# EAGLE design Verna_Dorian_334CC (EAGLE 9.6.2)
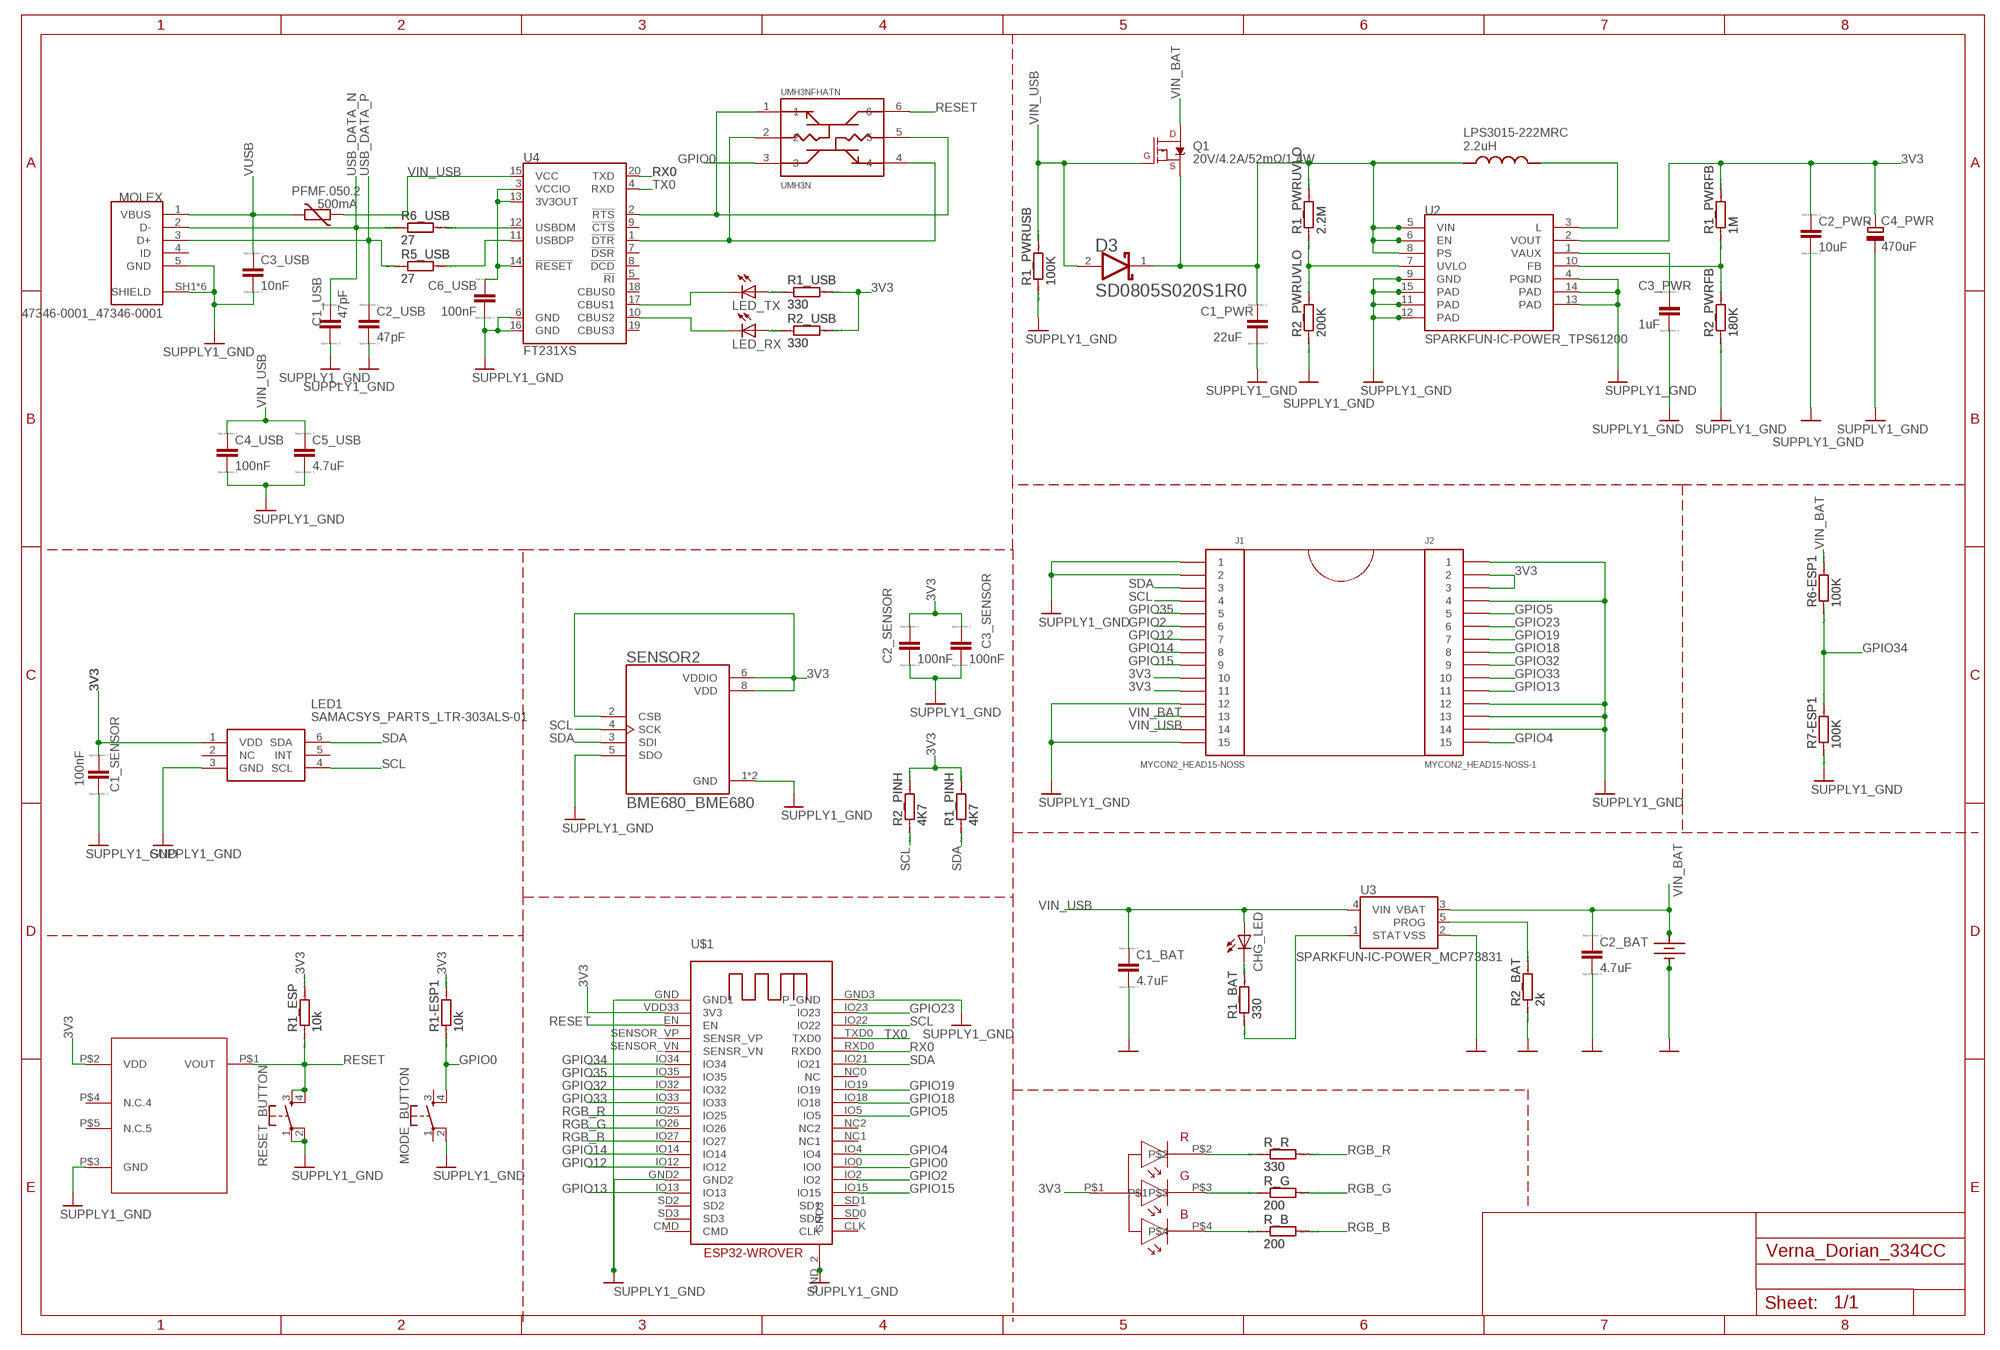
[diagram p0: schematic, sheet 1]

## Parts
18650BATTHOLDER  12BHC186CLP-GR_12BHC186CLP-GR  [12BHC186CLP-GR_12BHC186CLP-GR]
C1_BAT  4.7uF  EAGLE-LTSPICE_CC0402  [EAGLE-LTSPICE_C0402]
C1_PWR  22uF  EAGLE-LTSPICE_CC0402  [EAGLE-LTSPICE_C0402]
C1_SENSOR  100nF  EAGLE-LTSPICE_CC0402  [EAGLE-LTSPICE_C0402]
C1_USB  47pF  EAGLE-LTSPICE_CC0402  [EAGLE-LTSPICE_C0402]
C2_BAT  4.7uF  EAGLE-LTSPICE_CC0402  [EAGLE-LTSPICE_C0402]
C2_PWR  10uF  EAGLE-LTSPICE_CC0402  [EAGLE-LTSPICE_C0402]
C2_SENSOR  100nF  EAGLE-LTSPICE_CC0402  [EAGLE-LTSPICE_C0402]
C2_USB  47pF  EAGLE-LTSPICE_CC0402  [EAGLE-LTSPICE_C0402]
C3_PWR  1uF  EAGLE-LTSPICE_CC0402  [EAGLE-LTSPICE_C0402]
C3_SENSOR  100nF  EAGLE-LTSPICE_CC0402  [EAGLE-LTSPICE_C0402]
C3_USB  10nF  EAGLE-LTSPICE_CC0402  [EAGLE-LTSPICE_C0402]
C4_PWR  470uF  RCL_CPOL-EUD/7343-31R  [RCL_D/7343-31R]
C4_USB  100nF  EAGLE-LTSPICE_CC0402  [EAGLE-LTSPICE_C0402]
C5_USB  4.7uF  EAGLE-LTSPICE_CC0402  [EAGLE-LTSPICE_C0402]
C6_USB  100nF  EAGLE-LTSPICE_CC0402  [EAGLE-LTSPICE_C0402]
CHG_LED  ADAFRUIT_LEDCHIP-LED0603  [ADAFRUIT_CHIP-LED0603]
D3  AVX---SD0805S020S1R0_AVX_SD0805S020S1R0AVX_SD0805S020S1R0_0_0  [AVX---SD0805S020S1R0_AVX_SD0805S020S1R0_0]
J1  MYCON2_HEAD15-NOSS  [MYCON2_HEAD15-NOSS]
J2  MYCON2_HEAD15-NOSS-1  [MYCON2_HEAD15-NOSS-1]
LED1  SAMACSYS_PARTS_LTR-303ALS-01  [SAMACSYS_PARTS_LTR303ALS01]
LED_RX  ADAFRUIT_LEDCHIP-LED0603  [ADAFRUIT_CHIP-LED0603]
LED_TX  ADAFRUIT_LEDCHIP-LED0603  [ADAFRUIT_CHIP-LED0603]
MODE_BUTTON  SPARKFUN-SWITCHES_MOMENTARY-SWITCH-SPST-2-SMD-4.6X2.8MM  [SPARKFUN-SWITCHES_TACTILE_SWITCH_SMD_4.6X2.8MM]
MOLEX  47346-0001_47346-0001  [47346-0001_MOLEX_47346-0001]
PFMF.050.2  500mA  VARISTOR_VARISTORCN1812  [VARISTOR_CT/CN1812]
Q1  20V/4.2A/52mΩ/1.4W  SPARKFUN-DISCRETESEMI_MOSFET_PCH-DMG2305UX-7  [SPARKFUN-DISCRETESEMI_SOT23-3]
R1-ESP1  10k  EAGLE-LTSPICE_RR0402  [EAGLE-LTSPICE_R0402]
R1_BAT  330  EAGLE-LTSPICE_RR0402  [EAGLE-LTSPICE_R0402]
R1_ESP  10k  EAGLE-LTSPICE_RR0402  [EAGLE-LTSPICE_R0402]
R1_PINH  4K7  EAGLE-LTSPICE_RR0402  [EAGLE-LTSPICE_R0402]
R1_PWRFB  1M  EAGLE-LTSPICE_RR0402  [EAGLE-LTSPICE_R0402]
R1_PWRUSB  100K  EAGLE-LTSPICE_RR0402  [EAGLE-LTSPICE_R0402]
R1_PWRUVLO  2.2M  EAGLE-LTSPICE_RR0402  [EAGLE-LTSPICE_R0402]
R1_USB  330  EAGLE-LTSPICE_RR0402  [EAGLE-LTSPICE_R0402]
R2_BAT  2k  EAGLE-LTSPICE_RR0402  [EAGLE-LTSPICE_R0402]
R2_PINH  4K7  EAGLE-LTSPICE_RR0402  [EAGLE-LTSPICE_R0402]
R2_PWRFB  180K  EAGLE-LTSPICE_RR0402  [EAGLE-LTSPICE_R0402]
R2_PWRUVLO  200K  EAGLE-LTSPICE_RR0402  [EAGLE-LTSPICE_R0402]
R2_USB  330  EAGLE-LTSPICE_RR0402  [EAGLE-LTSPICE_R0402]
R5_USB  27  EAGLE-LTSPICE_RR0402  [EAGLE-LTSPICE_R0402]
R6-ESP1  100K  EAGLE-LTSPICE_RR0402  [EAGLE-LTSPICE_R0402]
R6_USB  27  EAGLE-LTSPICE_RR0402  [EAGLE-LTSPICE_R0402]
R7-ESP1  100K  EAGLE-LTSPICE_RR0402  [EAGLE-LTSPICE_R0402]
R_B  200  EAGLE-LTSPICE_RR0402  [EAGLE-LTSPICE_R0402]
R_G  200  EAGLE-LTSPICE_RR0402  [EAGLE-LTSPICE_R0402]
R_R  330  EAGLE-LTSPICE_RR0402  [EAGLE-LTSPICE_R0402]
RESET_BUTTON  SPARKFUN-SWITCHES_MOMENTARY-SWITCH-SPST-2-SMD-4.6X2.8MM  [SPARKFUN-SWITCHES_TACTILE_SWITCH_SMD_4.6X2.8MM]
SENSOR2  BME680_BME680  [BME680_PSON80P300X300X100-8N]
U2  SPARKFUN-IC-POWER_TPS61200  [SPARKFUN-IC-POWER_QFN-10_PAD]
U3  SPARKFUN-IC-POWER_MCP73831  [SPARKFUN-IC-POWER_SOT23-5]
U4  FT231XS  SPARKFUN-IC-COMMS_FT231XS  [SPARKFUN-IC-COMMS_SSOP20_L]
U$1  ESP32-WROVER_ESP32-WROVER  [ESP32-WROVER_ESP32-WROVER]
U$2  150202M153130_150202M153130-RGB  [150202M153130_150202M153130]
U$3  BD48E27G-TR_BD48E27G-TR  [BD48E27G-TR_SSOP5]
U$6  LPS3015_LPS3015  [LPS3015_LPS3015-222MRC]
UMH3NFHATN  UMH3N_UMH3N  [UMH3N_SOP65P210X100-6N]

## Nets
3V3: C1_SENSOR.1 C2_PWR.1 C2_SENSOR.1 C3_SENSOR.1 C4_PWR.+ J1.10 J1.11 J2.2 J2.3 LED1.1(VDD) R1-ESP1.2 R1_ESP.2 R1_PINH.2 R1_PWRFB.2 R1_USB.2 R2_PINH.2 R2_USB.2 SENSOR2.2(CSB) SENSOR2.6(VDDIO) SENSOR2.8(VDD) U2.2(VOUT) U$1.VDD33(3V3) U$2.P$1 U$3.P$2(VDD)
GND: 18650BATTHOLDER.P$1(G) 18650BATTHOLDER.P$3(G) 18650BATTHOLDER.P$4(G) C1_BAT.2 C1_PWR.2 C1_SENSOR.2 C1_USB.2 C2_BAT.2 C2_PWR.2 C2_SENSOR.2 C2_USB.2 C3_PWR.2 C3_SENSOR.2 C3_USB.2 C4_PWR.- C4_USB.2 C5_USB.2 C6_USB.2 J1.1 J1.2 J1.12 J1.15 J2.1 J2.4 J2.12 J2.13 J2.14 LED1.3(GND) MODE_BUTTON.2 MOLEX.5(GND) MOLEX.SH1(SHIELD) MOLEX.SH2(SHIELD) MOLEX.SH3(SHIELD) MOLEX.SH4(SHIELD) MOLEX.SH5(SHIELD) MOLEX.SH6(SHIELD) R1_PWRUSB.1 R2_BAT.1 R2_PWRFB.1 R2_PWRUVLO.1 R7-ESP1.1 RESET_BUTTON.1 RESET_BUTTON.2 SENSOR2.1(GND) SENSOR2.5(SDO) SENSOR2.7(GND) U2.4(PGND) U2.9(GND) U2.11(PAD) U2.12(PAD) U2.13(PAD) U2.14(PAD) U2.15(PAD) U3.2(VSS) U4.6(GND) U4.16(GND) U$1.GND2 U$1.GND3(P_GND) U$1.GND(GND1) U$1.GND_2(GND3) U$3.P$3(GND) ; supply symbol labelled SUPPLY1_GND
GPIO0: MODE_BUTTON.4 R1-ESP1.1 U$1.IO0 UMH3NFHATN.3
GPIO2: J1.6 U$1.IO2
GPIO4: J2.15 U$1.IO4
GPIO5: J2.5 U$1.IO5
GPIO12: J1.7 U$1.IO12
GPIO13: J2.11 U$1.IO13
GPIO14: J1.8 U$1.IO14
GPIO15: J1.9 U$1.IO15
GPIO18: J2.8 U$1.IO18
GPIO19: J2.7 U$1.IO19
GPIO23: J2.6 U$1.IO23
GPIO32: J2.9 U$1.IO32
GPIO33: J2.10 U$1.IO33
GPIO34: R6-ESP1.1 R7-ESP1.2 U$1.IO34
GPIO35: J1.5 U$1.IO35
N$1: R_R.1 U$2.P$2
N$2: R_G.1 U$2.P$3
N$3: R_B.1 U$2.P$4
N$4: U2.3(L) U$6.P$2
N$5: CHG_LED.C R1_BAT.2
N$6: R1_BAT.1 U3.1(STAT)
N$7: R2_BAT.2 U3.5(PROG)
N$8: R6_USB.2 U4.12(USBDM)
N$9: C3_PWR.1 U2.1(VAUX)
N$11: R5_USB.2 U4.11(USBDP)
N$12: R1_PWRUVLO.1 R2_PWRUVLO.2 U2.7(UVLO)
N$13: R1_PWRFB.1 R2_PWRFB.2 U2.10(FB)
N$17: C6_USB.1 U4.3(VCCIO) U4.13(3V3OUT) U4.14(!RESET)
N$20: LED_TX.C U4.17(CBUS1)
N$21: LED_RX.C U4.10(CBUS2)
N$22: LED_TX.A R1_USB.1
N$23: LED_RX.A R2_USB.1
N$25: U4.1(!DTR) UMH3NFHATN.2 UMH3NFHATN.4
N$27: U4.2(!RTS) UMH3NFHATN.1 UMH3NFHATN.5
RESET: R1_ESP.1 RESET_BUTTON.3 RESET_BUTTON.4 U$1.EN U$3.P$1(VOUT) UMH3NFHATN.6
RGB_B: R_B.2 U$1.IO27
RGB_G: R_G.2 U$1.IO26
RGB_R: R_R.2 U$1.IO25
RX0: U4.20(TXD) U$1.RXD0
SCL: J1.4 LED1.4(SCL) R2_PINH.1 SENSOR2.4(SCK) U$1.IO22
SDA: J1.3 LED1.6(SDA) R1_PINH.1 SENSOR2.3(SDI) U$1.IO21
TX0: U4.4(RXD) U$1.TXD0
USB_DATA_N [New Class]: C1_USB.1 MOLEX.2(D-) R6_USB.1
USB_DATA_P [New Class]: C2_USB.1 MOLEX.3(D+) R5_USB.1
VIN: C1_PWR.1 D3.1(CATHODE) Q1.2(S) R1_PWRUVLO.2 U2.5(VIN) U2.6(EN) U2.8(PS) U$6.P$1
VIN_BAT: 18650BATTHOLDER.P$2(P) 18650BATTHOLDER.P$5(P) 18650BATTHOLDER.P$6(P) C2_BAT.1 J1.13 Q1.3(D) R6-ESP1.2 U3.3(VBAT)
VIN_USB: C1_BAT.1 C4_USB.1 C5_USB.1 CHG_LED.A D3.2(ANODE) J1.14 PFMF.050.2.1 Q1.1(G) R1_PWRUSB.2 U3.4(VIN) U4.15(VCC)
VUSB: C3_USB.1 MOLEX.1(VBUS) PFMF.050.2.2
Unconnected: LED1.2(NC) LED1.5(INT) MODE_BUTTON.1 MODE_BUTTON.3 MOLEX.4(ID) U4.5(!RI) U4.7(!DSR) U4.8(!DCD) U4.9(!CTS) U4.18(CBUS0) U4.19(CBUS3) U$1.CLK U$1.CMD U$1.NC0(NC) U$1.NC1 U$1.NC2 U$1.SD0 U$1.SD1 U$1.SD2 U$1.SD3 U$1.SENSOR_VN(SENSR_VN) U$1.SENSOR_VP(SENSR_VP) U$3.P$4(N.C.4) U$3.P$5(N.C.5)

## Library data of the parts
18650BATTHOLDER = ESP32_WROVER:12BHC186CLP-GR_12BHC186CLP-GR
C1_BAT C1_PWR C1_SENSOR C1_USB C2_BAT C2_PWR C2_SENSOR C2_USB C3_PWR C3_SENSOR C3_USB C4_USB C5_USB C6_USB = ESP32_WROVER:EAGLE-LTSPICE_C: CAPACITOR, European symbol; SPICEMODEL: NONE; SPICEPREFIX: C
C4_PWR = ESP32_WROVER:RCL_CPOL-EU: POLARIZED CAPACITOR, European symbol; SPICEPREFIX: C
CHG_LED LED_RX LED_TX = ESP32_WROVER:ADAFRUIT_LED: LED OSRAM: - CHIPLED LG R971, LG N971, LY N971, LG Q971, LY Q971, LO R971, LY R971 LH N974, LH R974 LS Q976, LO Q976, LY Q976 LO Q996 - Hyper CHIPLED LW Q18S LB Q993, LB Q99A, LB R99A - SideLED LS A670, LO A670, LY A670, LG A670, LP A670 LB A673, LV A673, LT A673, LW A673 LH A674 LY A675 LS A676, LA A676, LO A676, LY A676, LW A676 LS A679, LY A679, LG A679 - Hyper Micro SIDELED® LS Y876, LA Y876, LO Y876, LY Y876 LT Y87S - SmartLED LW L88C, LW L88S LB L89C, LB L89S, LG L890 LS L89K, LO L89K, LY L89K LS L896, LA L896, LO L896, LY L896 - TOPLED LS T670, LO T670, LY T670, LG T670, LP T670 LSG T670, LSP T670, LSY T670, LOP T670, LYG T670 LG T671, LOG T671, LSG T671 LB T673, LV T673, LT T673, LW T673 LH T674 LS T676, LA T676, LO T676, LY T676, LB T676, LH T676, LSB T676, LW T676 LB T67C, LV T67C, LT T67C, LS T67K, LO T67K, LY T67K, LW E67C LS E67B, LA E67B, LO E67B, LY E67B, LB E67C, LV E67C, LT E67C LW T67C LS T679, LY T679, LG T679 LS T770, LO T770, LY T770, LG T770, LP T770 LB T773, LV T773, LT T773, LW T773 LH T774 LS E675, LA E675, LY E675, LS T675 LS T776, LA T776, LO T776, LY T776, LB T776 LHGB T686 LT T68C, LB T68C - Hyper Mini TOPLED® LB M676 - Mini TOPLED Santana® LG M470 LS M47K, LO M47K, LY M47K Source: http://www.osram.convergy.de/
D3 = ESP32_WROVER:AVX---SD0805S020S1R0_AVX_SD0805S020S1R0: Schottky Barrier Rectifier Diode; CENTROID_NOT_SPECIFIED: No; DATASHEET: http://datasheets.avx.com/schottky.pdf; DIGIKEY_DESCRIPTION: DIODE SCHOTTKY 20V 1A 0805; DIGIKEY_PART_NUMBER: 478-7800-1-ND; LEAD_FREE: yes; MF: AVX; MOUSER_PART_NUMBER: 581-SD0805S020S1R0; MPN: SD0805S020S1R0; PACKAGE: 0805 (2012 metric); PREFIX: D; ROHS: yes; TEMPERATURE_RANGE_HIGH: +125°C; TEMPERATURE_RANGE_LOW: -55°C
J1 = ESP32_WROVER:MYCON2_HEAD15-NOSS
J2 = ESP32_WROVER:MYCON2_HEAD15-NOSS-1
LED1 = ESP32_WROVER:SAMACSYS_PARTS_LTR-303ALS-01: Ambient Light Sensors Ambient Light Photo Sensor Source: Datasheet <http://optoelectronics.liteon.com/upload/download/DS86-2013-0004/LTR-303ALS-01_DS_V1.pdf>; ARROW_PART_NUMBER: LTR-303ALS-01; ARROW_PRICE-STOCK: https://www.arrow.com/en/products/ltr-303als-01/lite-on-technology?region=nac; DESCRIPTION: Ambient Light Sensors Ambient Light Photo Sensor; HEIGHT: 0mm; MANUFACTURER_NAME: Lite-On; MANUFACTURER_PART_NUMBER: LTR-303ALS-01; MOUSER_PART_NUMBER: 859-LTR-303ALS-01; MOUSER_PRICE-STOCK: https://www.mouser.co.uk/ProductDetail/Lite-On/LTR-303ALS-01?qs=Ml%2FaxAEbwm%252Bm%252BetMkBDC8g%3D%3D
MODE_BUTTON RESET_BUTTON = ESP32_WROVER:SPARKFUN-SWITCHES_MOMENTARY-SWITCH-SPST-2: Momentary Switch (Pushbutton) - SPST - Two Circuits Normally-open (NO) SPST momentary switches (buttons, pushbuttons). Schematic symbol includes two switch circuits. Variants SMD-4.6MMX2.8MM - 4.60mm x 2.80mm Tactile Momentary Button Switch - Used on SparkFun SAMD21 Mini Breakout <https://www.sparkfun.com/products/13664> SMD-5.2MM - Mini Pushbutton Switch - SMD <https://www.sparkfun.com/products/8720> - Used on Arduino Pro Mini <https://www.sparkfun.com/products/11114>; PROD_ID: SWCH-14139; SF_SKU: COM-08720
MOLEX = ESP32_WROVER:47346-0001_47346-0001: CONN RCPT 5POS MICRO USB R/A SMD Check prices <https://pricing.snapeda.com/parts/47346-0001/Molex/view-part?ref=eda>; AVAILABILITY: Warning; DESCRIPTION: USB - micro B USB 2.0 Receptacle Connector 5 Position Surface Mount, Right Angle; MF: Molex; MP: 47346-0001; PACKAGE: None; PRICE: None
PFMF.050.2 = ESP32_WROVER:VARISTOR_VARISTOR: VARISTOR
Q1 = ESP32_WROVER:SPARKFUN-DISCRETESEMI_MOSFET_PCH: P-channel MOSFETs Voltage controlled devices that allow control of high current outputs. SparkFun Products: SparkFun ESP32 Thing <https://www.sparkfun.com/products/13907> SparkFun ESP8266 Thing <https://www.sparkfun.com/products/13231> SparkFun Pi Servo HAT V2 <https://www.sparkfun.com/products/15316> DMG2305UX-7 (20V/4.2A/SOT23-3); PROD_ID: TRAN-14388
R1-ESP1 R1_BAT R1_ESP R1_PINH R1_PWRFB R1_PWRUSB R1_PWRUVLO R1_USB R2_BAT R2_PINH R2_PWRFB R2_PWRUVLO R2_USB R5_USB R6-ESP1 R6_USB R7-ESP1 R_B R_G R_R = ESP32_WROVER:EAGLE-LTSPICE_R: RESISTOR, European symbol; SPICEMODEL: NONE; SPICEPREFIX: R
SENSOR2 = ESP32_WROVER:BME680_BME680: Integrated Environmental Unit; AVAILABILITY: Unavailable; DESCRIPTION: Integrated Environmental Unit; MF: Bosch Sensortec; MP: BME680; PACKAGE: LGA-8 Bosch Tools; PRICE: None
U2 = ESP32_WROVER:SPARKFUN-IC-POWER_TPS61200: DC to DC Booster IC-10035; PROD_ID: IC-10035
U3 = ESP32_WROVER:SPARKFUN-IC-POWER_MCP73831: MCP73831T Li-Ion, Li-Pol Controller Miniature single cell, fully integrated Li-Ion, Li-polymer charge management controller Datasheet <http://ww1.microchip.com/downloads/en/DeviceDoc/20001984g.pdf> SparkFun Products: SparkFun ESP32 Thing <https://www.sparkfun.com/products/13907> SparkFun 9DoF Razor IMU M0 <https://www.sparkfun.com/products/14001>; PROD_ID: IC-09995
U4 = ESP32_WROVER:SPARKFUN-IC-COMMS_FT231X: FTDI FT231X Full Speed USB to Full-handshake UART This USB2.0 Full Speed IC offers a compact bridge to full handshake UART interfaces. The device is a UART, capable of operating up to 3MBaud, with low power consumption (8mA). The FT231X includes the complete FT-X series feature set and enables USB to be added into a system design quickly and easily over a UART interface. Datasheet <http://cdn.sparkfun.com/datasheets/Components/General%20IC/DS_FT231X.pdf> SparkFun Products SparkFun RedBoard - Programmed with Arduino <https://www.sparkfun.com/products/12757> (DEV-12757) SparkFun XBee Explorer USB <https://www.sparkfun.com/products/11812> (WRL-11812) SparkFun XBee Explorer Dongle <https://www.sparkfun.com/products/11697> (WRL-11697) SparkFun Blynk Board - ESP8266 <https://www.sparkfun.com/products/13794> (WRL-13794) SparkFun ESP8266 Thing - Dev Board <https://www.sparkfun.com/products/13711> (WRL-13711) SparkFun Block for Intel® Edison - Base <https://www.sparkfun.com/products/13045> (DEV-13045) SparkFun RedStick <https://www.sparkfun.com/products/13741> (DEV-13741) SparkFun Beefy 3 - FTDI Basic Breakout <https://www.sparkfun.com/products/13746> (DEV-13746) SparkFun FT231X Breakout <https://www.sparkfun.com/products/11736> (BOB-11736); PROD_ID: IC-11524
U$1 = ESP32_WROVER:ESP32-WROVER_ESP32-WROVER
U$2 = ESP32_WROVER:150202M153130_150202M153130-RGB
U$3 = ESP32_WROVER:BD48E27G-TR_BD48E27G-TR
U$6 = ESP32_WROVER:LPS3015_LPS3015
UMH3NFHATN = ESP32_WROVER:UMH3N_UMH3N: Dual PNP/NPN transistor for chip reset; AVAILABILITY: Unavailable; DESCRIPTION: Pre-Biased Bipolar Transistor (BJT) 2 NPN - Pre-Biased (Dual) 50V 100mA 250MHz 150mW Surface Mount UMT6; MF: Rohm; MP: UMH3N; PACKAGE: SOT-363 Rohm; PRICE: None

## Board
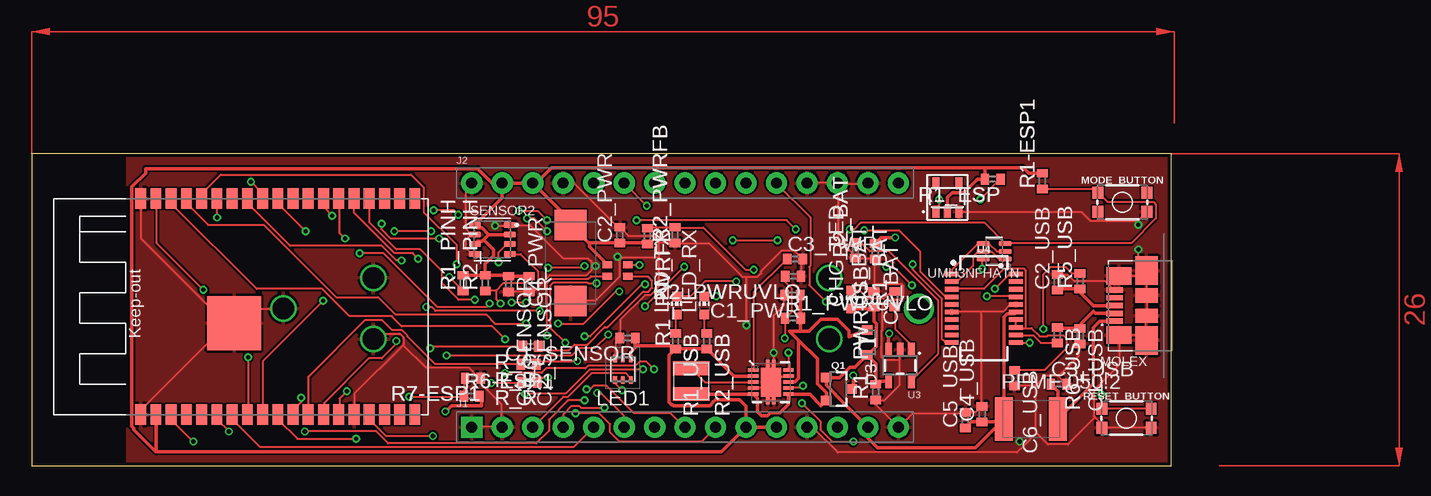
[diagram p1: board, top side]
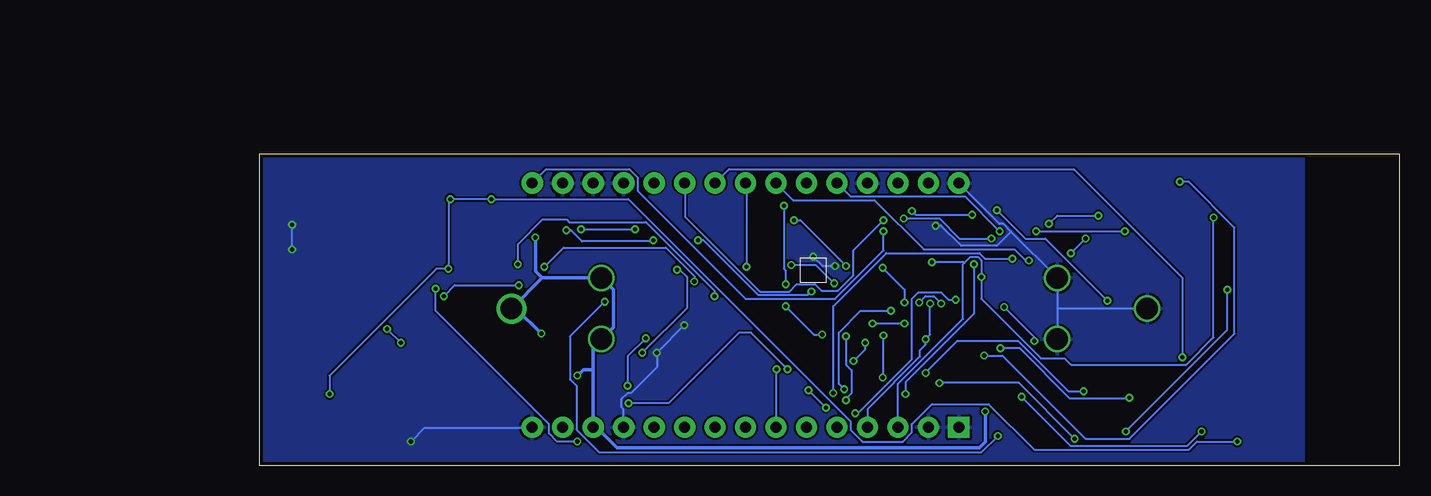
[diagram p2: board, bottom side, seen from below]

Size 95 x 26 mm. Coordinates in mm from the lower left corner, seen from the top.
Outline: 0,0 95,0 95,26 0,26 0,0
Copper layers (1*16): Top 0.035mm / dielectric 1.5mm / Bottom 0.035mm
Design rules "PCB-POOL Standard": minimum track width 0.15mm, minimum drill 0.3mm, track to track 0.15mm, track to pad 0.15mm, pad to pad 0.15mm, via to via 0.15mm, smd to smd 0.15mm, copper to edge 0.3mm, drill to drill 0.2mm, minimum pad ring 0.2mm, minimum via ring 0.15mm, stop-mask expansion 0.03mm, vias tented up to drill 0mil, thermal gap 0.2mm

### Footprints (pad centres in the part's own frame; a part is rotated, then mirrored left to right if it is on the bottom)
12BHC186CLP-GR_12BHC186CLP-GR = drill 1.8: P$1 -26.5,0; P$3 -19,2.55; P$4 -19,-2.55; P$5 19,2.55; P$6 19,-2.55 | drill 1.8 pad 2.5: P$2 26.5,0
EAGLE-LTSPICE_C0402 = smd 0.7 x 0.9: 1 -0.65,0; 2 0.65,0
RCL_D/7343-31R = smd 2.55 x 2.7: + 3.175,0; - -3.175,0
ADAFRUIT_CHIP-LED0603 = smd 0.8 x 0.8: A 0,-0.75; C 0,0.75
AVX---SD0805S020S1R0_AVX_SD0805S020S1R0_0 = smd 0.8 x 0.9: 1 -1.05,0; 2 1.05,0
MYCON2_HEAD15-NOSS = drill 0.914 pad 1.778 square: 1 0,0 | drill 0.914 pad 1.778: 2 2.54,0; 3 5.08,0; 4 7.62,0; 5 10.16,0; 6 12.7,0; 7 15.24,0; 8 17.78,0; 9 20.32,0; 10 22.86,0; 11 25.4,0; 12 27.94,0; 13 30.48,0; 14 33.02,0; 15 35.56,0
MYCON2_HEAD15-NOSS-1 = drill 0.914 pad 1.778: 1 0,0; 2 2.54,0; 3 5.08,0; 4 7.62,0; 5 10.16,0; 6 12.7,0; 7 15.24,0; 8 17.78,0; 9 20.32,0; 10 22.86,0; 11 25.4,0; 12 27.94,0; 13 30.48,0; 14 33.02,0; 15 35.56,0
SAMACSYS_PARTS_LTR303ALS01 = smd 0.3 x 0.65: 1 -0.65,-0.9; 2 0,-0.9; 3 0.65,-0.9; 4 0.65,0.9; 5 0,0.9; 6 -0.65,0.9
SPARKFUN-SWITCHES_TACTILE_SWITCH_SMD_4.6X2.8MM = smd 0.9 x 1: 1 -2.05,-0.8; 2 2.05,-0.8; 3 2.05,0.8; 4 -2.05,0.8
47346-0001_MOLEX_47346-0001 = smd 0.45 x 1.38: 1 -1.3,2.66; 2 -0.65,2.66; 3 0,2.66; 4 0.65,2.66; 5 1.3,2.66 | smd 1.475 x 2.1: SH1 -2.462,2.3; SH2 2.462,2.3 | smd 2.375 x 1.9: SH3 -2.913,0; SH6 2.913,0 | smd 1.175 x 1.9: SH4 -0.838,0; SH5 0.838,0
VARISTOR_CT/CN1812 = smd 1.5 x 3.6: 1 -2.25,0; 2 2.25,0
SPARKFUN-DISCRETESEMI_SOT23-3 = smd 0.8 x 0.9: 1 -0.95,-1; 2 0.95,-1; 3 0,1.1
EAGLE-LTSPICE_R0402 = smd 0.7 x 0.9: 1 -0.65,0; 2 0.65,0
BME680_PSON80P300X300X100-8N = smd 1.016 x 0.5: 1 1.458,1.2; 2 1.458,0.4; 3 1.458,-0.4; 4 1.458,-1.2; 5 -1.458,-1.22; 6 -1.458,-0.4; 7 -1.458,0.4; 8 -1.458,1.2
SPARKFUN-IC-POWER_QFN-10_PAD = smd 0.297 x 0.85: 1 -1,-1.475; 2 -0.5,-1.475; 3 0,-1.475; 4 0.5,-1.475; 5 1,-1.475; 6 1,1.475; 7 0.5,1.475; 8 0,1.475; 9 -0.5,1.475; 10 -1,1.475 | smd 0.7 x 0.28: 11 -1.5,0.25; 12 -1.5,-0.25; 13 1.5,0.25; 14 1.5,-0.25 | smd 2.4 x 1.65: 15 0,0
SPARKFUN-IC-POWER_SOT23-5 = smd 0.55 x 1.2: 1 -0.95,-1.3; 2 0,-1.3; 3 0.95,-1.3; 4 0.95,1.3; 5 -0.95,1.3
SPARKFUN-IC-COMMS_SSOP20_L = smd 0.381 x 1.143: 1 -2.857,-2.68; 2 -2.223,-2.68; 3 -1.587,-2.68; 4 -0.953,-2.68; 5 -0.318,-2.68; 6 0.318,-2.68; 7 0.953,-2.68; 8 1.587,-2.68; 9 2.223,-2.68; 10 2.857,-2.68; 11 2.857,2.68; 12 2.223,2.68; 13 1.587,2.68; 14 0.953,2.68; 15 0.318,2.68; 16 -0.318,2.68; 17 -0.953,2.68; 18 -1.587,2.68; 19 -2.223,2.68; 20 -2.857,2.68
ESP32-WROVER_ESP32-WROVER = smd 1.7 x 0.9: CLK 18,1.27; CMD 0,1.27; EN 0,21.59; GND 0,24.13; GND3 18,24.13; GND_2 0,6.35; IO0 18,7.62; IO2 18,6.35; IO4 18,8.89; IO5 18,12.7; IO12 0,7.62; IO13 0,5.08; IO14 0,8.89; IO15 18,5.08; IO18 18,13.97; IO19 18,15.24; IO21 18,17.78; IO22 18,21.59; IO23 18,22.86; IO25 0,12.7; IO26 0,11.43; IO27 0,10.16; IO32 0,15.24; IO33 0,13.97; IO34 0,17.78; IO35 0,16.51; NC0 18,16.51; NC1 18,10.16; NC2 18,11.43; RXD0 18,19.05; SD0 18,2.54; SD1 18,3.81; SD2 0,3.81; SD3 0,2.54; SENSOR_VN 0,19.05; SENSOR_VP 0,20.32; TXD0 18,20.32; VDD33 0,22.86 | smd 4.5 x 4.5: GND2 7.62,16.34
150202M153130_150202M153130 = smd 0.8 x 0.6: P$1 -0.85,0.475; P$2 -0.85,-0.475; P$3 0.85,-0.475; P$4 0.85,0.475
BD48E27G-TR_SSOP5 = smd 0.6 x 1: P$1 -0.95,-0.8; P$2 0,-0.8; P$3 0.95,-0.8; P$4 0.95,1.6; P$5 -0.95,1.6
LPS3015_LPS3015-222MRC = smd 1.14 x 3.05: P$1 1.075,-0.025; P$2 -1.075,-0.025
UMH3N_SOP65P210X100-6N = smd 1.09 x 0.4: 1 -0.92,0.65; 2 -0.92,0; 3 -0.92,-0.65; 4 0.92,-0.65; 5 0.92,0; 6 0.92,0.65

### Placement (x,y rotation side)
18650BATTHOLDER  47.49,13.09 180 bottom
C1_BAT  70.23,13.87 90 top
C1_PWR  63.43,14.21 180 top
C1_SENSOR  49.67,10.63 180 top
C1_USB  87.4,10.79 270 top
C2_BAT  70.34,17.87 270 top
C2_PWR  49.04,19.21 90 top
C2_SENSOR  41.47,15.13 270 top
C2_USB  85.51,15.29 90 top
C3_PWR  63.65,17.21 0 top
C3_SENSOR  39.77,15.13 270 top
C3_USB  85.62,6.79 0 top
C4_PWR  44.93,16.88 90 top
C4_USB  79.23,4.29 90 top
C5_USB  77.84,3.79 90 top
C6_USB  81.95,7.29 270 top
CHG_LED  68.33,13.84 0 top
D3  69.66,10.26 270 top
J1  36.7,3.2 0 top
J2  36.7,23.55 0 top
LED1  49.29,8.03 180 top
LED_RX  56.08,13.34 0 top
LED_TX  53.77,13.34 0 top
MODE_BUTTON  90.93,21.95 0 top
MOLEX  92.95,13.34 90 top
PFMF.050.2  83.32,3.88 0 top
Q1  67.25,6.38 270 top
R1-ESP1  84.26,23.71 90 top
R1_BAT  71.95,13.87 90 top
R1_ESP  80.12,23.87 180 top
R1_PINH  35.98,15.21 90 top
R1_PWRFB  51.34,19.13 270 top
R1_PWRUSB  70.37,6.13 90 top
R1_PWRUVLO  63.46,12.28 0 top
R1_USB  53.68,10.37 270 top
R2_BAT  68.68,17.95 90 top
R2_PINH  37.82,15.21 90 top
R2_PWRFB  53.64,19.21 90 top
R2_PWRUVLO  63.49,15.78 180 top
R2_USB  56.29,10.37 270 top
R5_USB  87.4,15.37 90 top
R6-ESP1  36.68,5.79 0 top
R6_USB  85.51,10.87 270 top
R7-ESP1  36.79,7.29 180 top
R_B  41.44,8.45 180 top
R_G  41.6,9.95 180 top
R_R  41.52,6.95 180 top
RESET_BUTTON  91.28,3.95 0 top
SENSOR2  38.41,18.85 0 top
U2  61.63,6.95 270 top
U3  72.4,8.35 180 top
U4  79.38,13.11 270 top
U$1  33.23,4.25 90 top
U$2  48.85,16.26 0 top
U$3  76.35,21.95 0 top
U$6  55.01,7.03 270 top
UMH3NFHATN  80.24,17.85 180 top

### Tracks (layer width: path | path; a pad name or v marks a point on that pad's centre or on a via)
3V3
  Top 0.3: J1.10 J1.11 | R1_USB.2 R2_USB.2 58.56,7.45 U2.2 | 41.91,23.42 J2.3 J2.2 | 41.91,23.42 44.93,20.4 C4_PWR.+ 46.42,18.56 46.5,18.56 | R1_PWRFB.2 51.26,18.56 C2_PWR.1 46.5,18.56 | 50.32,10 50.32,9.82 49.94,9.44 LED1.1 | 50.32,10 C1_SENSOR.1 | J1.10 57.53,1.17 10.5,1.17 | J2.2 38.38,23.55 37.19,24.74 9.5,24.74 9.5,24.38 8.35,23.22 8.35,3.27 8.5,3.12 8.5,3 10.33,1.17 10.5,1.17 | 50.32,10 53.4,10 R1_USB.2 | SENSOR2.6 37.2,18.7 37.55,18.7 37.68,18.82 | 38.1,19.25 SENSOR2.2 | 37.68,18.82 38.1,19.25 | J2.2 39.24,22.34 SENSOR2.8 37.2,19.8 37.55,19.8 38.1,19.25 | C2_SENSOR.1 C3_SENSOR.1 39.69,15.86 R2_PINH.2 | R1_PINH.2 R2_PINH.2 | R2_PINH.2 37.82,16.82 38.5,17.5 38.5,18 37.68,18.82 | R1-ESP1.2 83.14,24.36 82.67,24.83 79.5,24.83 | 41.91,23.42 43.33,24.83 79.5,24.83 | 79.5,24.83 79.47,24.8 R1_ESP.2 78.85,23.87 77.72,22.75 76.75,22.75 76.35,22.35 U$3.P$2 | U$2.P$1 46.5,18.23 46.5,18.56 | U$1.VDD33 10.37,1.3 10.5,1.17 | R1_USB.2 53.16,9.2 53.16,5.26 53.34,5.08 53.42,5.08 53.5,5 56.55,5 56.81,5.26 56.81,5.31 57,5.5 59,5.5 59.56,4.94 J1.10
GND  (via drill 0.35)
  Top 0.152: U$1.GND 9.14,4.29 9.14,4.67 16.31,11.84 16.84,11.84 U$1.GND2 | U$1.GND3 9.14,22.2 9.14,18.92 16.23,11.84 U$1.GND2 | 18650BATTHOLDER.P$1 20.95,13.06 18.06,13.06 16.92,11.91 U$1.GND2 | J1.1 36.73,3.23 39.09,3.23 J1.2 39.17,3.23 39.17,5.13 37.49,6.81 37.49,7.27 R7-ESP1.1 37.41,7.34 37.26,7.34 36.42,8.18 32.84,8.18 30.98,10.05 | 30.98,10.05 31.01,10.08 31.01,10.69 30.71,11 28.96,11 18650BATTHOLDER.P$3 | 30.98,10.05 26.9,5.97 26.9,4.29 U$1.GND_2 | C3_SENSOR.2 39.78,14.5 41.45,14.5 C2_SENSOR.2 41.53,14.5 41.83,14.5 43.2,15.88 46.25,15.88 46.71,16.33 46.71,16.64 | 46.71,16.64 46.71,16.94 46.41,17.25 44.35,17.25 41.6,19.99 39.93,19.99 SENSOR2.1 39.85,19.99 v38.63,19.99 | SENSOR2.5 36.88,17.7 36.65,17.7 36.2,18.16 36.2,18.77 36.65,19.23 36.88,19.23 SENSOR2.7 36.58,19.23 36.58,19.38 36.2,19.76 36.2,23.04 36.65,23.5 J2.1 | 70.26,15.11 70.26,17.09 70.33,17.17 C2_BAT.2 70.33,17.25 68.73,17.25 R2_BAT.1 68.66,17.32 68.66,17.48 67.21,18.92 67.21,23.5 J2.13 | 70.26,15.11 70.26,14.58 C1_BAT.2 | J2.12 64.69,23.57 67.13,23.57 J2.13 | J2.14 69.65,23.5 67.28,23.5 J2.13 | 79.17,12.83 81,12.83 81.53,13.36 81.99,13.36 U4.16 | 79.17,12.83 76.73,12.83 U4.6 | 72.39,8.79 72.39,6.73 71.09,5.44 70.48,5.44 R1_PWRUSB.1 70.41,5.44 70.41,5.05 72.24,3.23 J1.15 72.31,3.23 73.46,4.37 77.8,4.37 C5_USB.2 77.88,4.45 78.72,4.45 79.17,4.9 C4_USB.2 79.17,4.98 79.17,12.83 | 72.39,8.79 72.39,9.63 U3.2 | 70.26,15.11 72.54,15.11 72.69,14.96 72.69,14.12 72.39,13.82 71.4,13.82 70.94,13.36 70.94,11.3 70.87,11.23 70.87,9.02 71.09,8.79 72.39,8.79 | LED1.3 48.69,8.94 48.69,10.31 49,10.62 C1_SENSOR.2 49.07,10.69 49.07,12.14 51.13,14.2 51.59,14.2 52.27,14.89 52.27,17.32
  Top 0.152: R2_PWRUVLO.1 64.16,15.8 64.16,17.09 64.24,17.17 C3_PWR.2 64.24,17.25 63.55,17.93 62.56,17.93 60.81,16.18 60.81,16.03 60.5,15.72 59.59,15.72 | 52.31,18.66 51.82,19.15 49.76,19.15 49.07,19.84 C2_PWR.2 49,19.91 48.84,19.91 45.26,23.5 44.35,23.5 J2.4 | 52.31,18.66 52.35,18.62 53.57,18.62 R2_PWRFB.1 53.65,18.54 56.46,18.54 59.28,15.72 59.59,15.72 | 52.27,17.32 52.27,18.62 52.31,18.66 | 49.07,17.17 49.23,17.32 52.27,17.32 | 49.07,17.17 49,17.09 49,15.72 47.02,13.74 44.96,13.74 C4_PWR.- | U2.12 61.42,8.48 61.87,8.48 U2.11 | U2.13 61.87,5.44 61.42,5.44 U2.14 61.34,5.51 61.34,6.58 U2.15 | U2.4 60.2,6.5 61.19,6.5 61.57,6.88 U2.15 | U2.9 63.09,7.42 62.1,7.42 61.65,6.96 U2.15 | U2.11 61.95,8.41 61.95,7.34 U2.15 | C1_PWR.2 62.71,14.2 62.71,13.36 61.87,12.52 v61.87,9.4 61.87,8.56 U2.11 | 92.24,20.41 92.96,21.13 MODE_BUTTON.2 | 92.24,20.41 92.2,20.37 88.32,20.37 87.55,21.13 77.34,21.13 U$3.P$3 | 83.71,6.69 84.51,7.49 85.57,7.49 85.61,7.45 | 83.71,6.69 83.67,6.66 81.99,6.66 C6_USB.2 | 85.61,7.45 86.26,6.81 C3_USB.2 | 85.61,7.45 87.33,9.17 87.33,10.08 C1_USB.2 | 89.84,15.04 90.22,14.66 MOLEX.5 | 89.84,15.04 89.53,15.34 86.94,15.34 86.41,15.88 85.57,15.88 C2_USB.2 | 89.84,15.04 90.6,15.8 MOLEX.SH2 90.68,15.8 92.96,15.8 | 92.96,15.8 92.96,14.2 MOLEX.SH5 92.96,14.12 92.96,12.52 MOLEX.SH4 92.89,12.45 92.89,11.15 92.58,10.85 MOLEX.SH3 92.89,10.47 92.51,10.85 90.68,10.85 MOLEX.SH1 90.68,10.77 90.68,8.41 88.54,6.27 88.54,4.14 88.66,4.03 | 92.96,15.8 92.96,16.18 MOLEX.SH6 | RESET_BUTTON.2 RESET_BUTTON.1 89.15,3.15 89.15,3.53 88.66,4.03 | 92.96,15.8 MOLEX.SH6 | 83.78,2.73 84.73,1.78 86.41,1.78 88.66,4.03
  Top 0.152: 83.78,2.73 83.74,2.77 83.74,6.66 83.71,6.69 | v92.28,20.07 92.28,20.37 92.24,20.41 | v92.28,18.01 92.28,17.02 92.96,16.33 MOLEX.SH6 | 83.78,2.73 82.72,1.66 | 82.72,1.66 82.14,1.09 67.21,1.09 65.15,3.15 64.69,3.15 J1.12 | v59.59,11.68 59.59,15.72 | 82.72,1.66 v82.37,2.01 | v47.02,16.64 46.71,16.64 | 49.07,17.17 v48.84,17.4
  Bottom 0.152: 32.35,19.5 18650BATTHOLDER.P$4 28.5,15.57 28.5,13.13 | 32.35,19.5 32.99,20.14 33.3,20.14 36.65,23.5 J2.1 | v38.63,19.99 38.18,19.99 36.5,18.31 33.53,18.31 32.35,19.5 | 28.5,13.13 18650BATTHOLDER.P$3 | 28.5,13.13 21.03,13.13 18650BATTHOLDER.P$1 | J1.12 64.69,3.23 64.69,4.75 64.85,4.9 64.85,5.51 64.31,6.05 64.01,6.05 61.87,8.18 v61.87,9.4 v59.59,11.68 | v92.28,18.01 v92.28,20.07 | v82.37,2.01 81.23,3.15 72.31,3.15 J1.15 | v47.02,16.64 48.08,16.64 v48.84,17.4
  pour Top: 8,26 8,0 95,0 95,26
  pour Bottom: 8,26 8,0 95,0 95,26
GPIO0  (via drill 0.35)
  Top 0.152: R1-ESP1.1 84.28,23.04 88.62,23.04 88.85,22.81 MODE_BUTTON.4 88.92,22.73 89.69,21.97 93.5,21.97 93.73,21.74 93.73,20.6 91.67,18.54 81.23,18.54 UMH3NFHATN.3 81.15,18.54 79.48,20.22 69.11,20.22 68.58,19.69 v68.2,19.69 | v26.14,18.92 25.68,19.38 25.68,22.2 U$1.IO0 | v27.36,17.7 29.34,17.7 33.83,13.21 37.87,13.21 v38.18,13.51 | v41.22,13.59 v40.01,13.59 | v43.05,16.48 45.95,16.48 v46.1,16.64 | v50.44,20.45 62.94,20.45 v63.7,19.69
  Bottom 0.152: v27.36,17.7 v26.14,18.92 | v38.18,13.51 38.79,14.12 39.47,14.12 v40.01,13.59 | v41.22,13.59 41.22,14.66 v43.05,16.48 | v46.1,16.64 49.91,20.45 v50.44,20.45 | v68.2,19.69 v63.7,19.69
GPIO2  (via drill 0.35)
  Top 0.152: v32.23,17.25 31.77,17.7 30.25,17.7 26.9,21.06 26.9,22.2 U$1.IO2 | v47.17,6.05 47.47,6.05 49.38,4.14 49.38,3.23 J1.6
  Bottom 0.152: v32.23,17.25 34.52,17.25 34.98,17.7 42.75,17.7 47.17,13.28 v47.17,6.05
GPIO4  (via drill 0.35)
  Top 0.152: v25.07,20.83 24.38,21.51 24.38,22.2 U$1.IO4 | v29.18,20.14 29.18,19.69 29.95,18.92 v33.98,18.92 | v41.3,20.6 41.91,20.6 v42.98,19.53
  Bottom 0.152: v25.07,20.83 28.5,20.83 v29.18,20.14 | v33.98,18.92 36.65,18.92 38.33,20.6 v41.3,20.6 | v42.98,19.53 42.98,17.93 47.02,13.89 54.48,13.89 63.48,22.89 63.48,24.03 64.16,24.72 71.09,24.72 72.24,23.57 J2.15
GPIO5  (via drill 0.35)
  Top 0.152: v22.86,19.53 20.57,21.82 20.57,22.2 U$1.IO5 | v33.3,19.53 v30.25,19.53
  Bottom 0.152: v30.25,19.53 v22.86,19.53 | v33.3,19.53 36.2,22.43 45.72,22.43 46.79,23.5 J2.5
GPIO12  (via drill 0.35)
  Top 0.152: v26.29,6.2 25.68,5.59 25.68,4.29 U$1.IO12 | v39.47,7.72 42.52,7.72 42.9,8.1 46.18,8.1 46.41,8.33 50.37,8.33 50.67,8.64 51.28,8.64 v51.89,8.03
  Bottom 0.152: v26.29,6.2 27.58,6.2 31.77,10.39 36.8,10.39 v39.47,7.72 | v51.89,8.03 51.89,3.23 J1.7
GPIO13  (via drill 0.35)
  Top 0.152: v33.45,2.46 29.57,2.46 28.19,3.84 28.19,4.22 U$1.IO13 | v66.22,13.67 64.85,15.04 64.85,16.56 64.92,16.64 64.92,20.68 62.1,23.5 J2.11
  Bottom 0.152: v33.45,2.46 34.82,1.09 66.67,1.09 68.58,3 68.58,6.66 69.11,7.19 69.11,10.77 v66.22,13.67
GPIO14  (via drill 0.35)
  Top 0.152: v30.4,10.39 30.4,10.16 29.18,8.94 28.12,8.94 24.38,5.21 24.38,4.29 U$1.IO14 | v32.92,13.21 33.38,13.21 33.68,12.9 v42.37,12.9 | v46.25,6.35 46.56,6.35 46.86,6.66 47.93,6.66 50.22,4.37 53.26,4.37 54.41,3.23 J1.8
  Bottom 0.152: v30.4,10.39 30.4,10.69 v32.92,13.21 | v42.37,12.9 44.88,12.9 46.71,11.08 46.71,6.81 v46.25,6.35
GPIO15  (via drill 0.35)
  Top 0.152: v36.96,13.82 35.59,13.82 34.21,15.19 34.21,16.18 32.38,18.01 30.4,18.01 28.19,20.22 28.19,22.2 U$1.IO15 | v45.34,4.37 47.32,4.37 48.23,3.45 48.23,2.77 49,2.01 55.85,2.01 57,3.15 J1.9
  Bottom 0.152: v36.96,13.82 37.57,13.82 38.18,14.43 40.08,14.43 40.62,13.89 40.62,8.87 45.11,4.37 v45.34,4.37
GPIO18  (via drill 0.35)
  Top 0.152: v18.29,23.65 19.2,22.73 19.2,22.28 U$1.IO18 | v34.59,9.17 45.03,9.17 45.64,9.78 46.94,9.78 v48.08,10.92 | v54.41,16.56 v51.13,13.28
  Bottom 0.152: v18.29,23.65 17.53,23.65 13.72,19.84 13.72,11 22.48,2.24 26.14,2.24 33.07,9.17 v34.59,9.17 | v48.08,10.92 48.77,10.92 v51.13,13.28 | v54.41,16.56 54.41,23.5 J2.8
GPIO19  (via drill 0.35)
  Top 0.152: v30.86,17.09 30.4,17.09 29.18,18.31 21.57,18.31 18.06,21.82 18.06,22.2 U$1.IO19
  Bottom 0.152: v30.86,17.09 31.17,17.09 32.08,18.01 39.62,18.01 43.74,22.12 50.52,22.12 51.89,23.5 J2.7
GPIO23  (via drill 0.35)
  Top 0.152: v14.33,14.66 10.44,18.54 10.44,22.2 U$1.IO23 | v22.78,2.84 28.73,2.84 29.72,1.85 42.06,1.85 43.13,2.92 43.13,3.84 44.73,5.44 v46.1,5.44 | v46.1,10.77 46.56,10.77 50.9,15.11 v51.13,15.11 | v51.28,21.67 49.45,23.5 J2.6
  Bottom 0.152: v14.33,14.66 14.33,11.3 v22.78,2.84 | v46.1,5.44 46.1,5.59 45.64,6.05 45.64,7.95 46.1,8.41 v46.1,10.77 | v51.13,15.11 51.13,16.26 51.28,16.41 v51.28,21.67
GPIO32  (via drill 0.35)
  Top 0.152: v18.06,9.02 18.06,4.29 U$1.IO32
  Bottom 0.152: v18.06,9.02 18.06,15.65 27.13,24.72 55.85,24.72 57,23.57 J2.9
GPIO33  (via drill 0.35)
  Top 0.152: v24.31,13.74 19.28,8.71 19.28,4.29 U$1.IO33 | v33.53,21.29 35.2,21.29 v35.59,20.91 | v40.62,21.21 42.22,21.21 v42.98,20.45
  Bottom 0.152: v24.31,13.74 29.49,18.92 31.17,18.92 v33.53,21.29 | v35.59,20.91 40.31,20.91 v40.62,21.21 | v42.98,20.45 45.49,17.93 45.49,15.88 46.79,14.58 48.16,14.58 48.69,15.11 50.22,15.11 50.83,14.5 53.26,14.5 59.51,20.75 59.51,23.5 J2.10
GPIO34  (via drill 0.35)
  Top 0.152: R7-ESP1.2 36.12,7.27 36.04,7.19 36.04,5.82 R6-ESP1.1 35.97,5.74 v31.47,5.74 | v16.46,2.84 15.47,3.84 15.47,4.22 U$1.IO34
  Bottom 0.152: v31.47,5.74 27.36,1.63 17.68,1.63 v16.46,2.84
GPIO35
  Top 0.152: U$1.IO35 16.76,4.22 16.76,3.84 19.05,1.55 45.19,1.55 46.79,3.15 J1.5
N$1  (via drill 0.35)
  Top 0.152: v42.98,10.85 42.98,15.19 43.36,15.57 46.41,15.57 46.63,15.8 47.93,15.8 U$2.P$2 | v43.05,7.34 42.6,7.34 42.22,6.96 R_R.1
  Bottom 0.152: v42.98,10.85 42.98,7.42 v43.05,7.34
N$2
  Top 0.152: U$2.P$3 49.76,15.72 51.44,15.72 51.74,15.42 51.74,14.81 51.44,14.5 50.98,14.5 48.01,11.53 47.78,11.53 46.33,10.08 45.26,10.08 44.81,9.63 42.6,9.63 42.29,9.93 R_G.1
N$3  (via drill 0.35)
  Top 0.152: v50.67,16.71 49.76,16.71 U$2.P$4 | v47.09,15.19 46.41,15.19 46.33,15.27 43.51,15.27 43.28,15.04 43.28,11.46 v44.5,10.24 | v45.49,8.71 42.37,8.71 42.14,8.48 R_B.1
  Bottom 0.152: v50.67,16.71 48.62,16.71 v47.09,15.19 | v44.5,10.24 44.5,9.7 v45.49,8.71
N$4
  Top 0.152: U2.3 60.12,6.96 56.16,6.96 55.02,8.1 U$6.P$2
N$5
  Top 0.152: CHG_LED.C 68.35,14.58 69.04,14.58 69.72,13.89 71.02,13.89 71.63,14.5 71.93,14.5 R1_BAT.2
N$6
  Top 0.152: R1_BAT.1 72.01,13.21 72.01,11.38 73.3,10.08 73.3,9.7 U3.1
N$7
  Top 0.152: R2_BAT.2 68.73,18.54 69.19,18.54 69.88,17.86 71.48,17.86 75.59,13.74 75.59,9.32 73.38,7.11 U3.5
N$8
  Top 0.152: R6_USB.2 85.5,10.24 84.12,10.24 83.52,10.85 82.07,10.85 U4.12
N$9
  Top 0.152: U2.1 60.2,7.95 60.2,14.43 62.94,17.17 C3_PWR.1
N$11  (via drill 0.35)
  Top 0.152: v84.35,11.38 84.35,15.95 84.96,16.56 86.18,16.56 86.72,16.03 87.33,16.03 R5_USB.2 | v83.21,10.24 82.07,10.24 U4.11
  Bottom 0.152: v83.21,10.24 v84.35,11.38
N$12  (via drill 0.35)
  Top 0.152: v64.31,6.66 64.16,6.5 63.17,6.5 U2.7 | v62.79,10.62 62.79,12.22 R1_PWRUVLO.1 62.87,12.29 63.4,12.83 63.4,14.73 62.87,15.27 62.87,15.72 R2_PWRUVLO.2
  Bottom 0.152: v64.31,6.66 64.31,9.09 v62.79,10.62
N$13  (via drill 0.35)
  Top 0.152: v63.09,9.4 63.09,7.95 U2.10 | v60.2,16.33 59.51,16.33 56.01,19.84 53.65,19.84 R2_PWRFB.2 53.57,19.84 51.36,19.84 R1_PWRFB.1
  Bottom 0.152: v63.09,9.4 59.36,13.13 59.36,15.72 59.97,16.33 v60.2,16.33
N$17
  Top 0.152: 82.91,11.46 82.07,11.46 U4.13 82.07,11.53 82.07,12.14 U4.14 | 82.91,11.46 83.36,11.46 84.05,10.77 84.66,10.77 84.73,10.85 86.03,10.85 86.26,10.62 86.26,9.78 84.43,7.95 81.99,7.95 C6_USB.1 | 82.91,11.46 82.91,16.26 82.75,16.41 81.08,16.41 79.4,14.73 76.73,14.73 U4.3
N$20  (via drill 0.35)
  Top 0.152: v58.75,15.34 56.16,15.34 54.94,14.12 53.8,14.12 LED_TX.C | v71.25,16.56 71.86,16.56 v73.38,15.04 | v79.63,14.12 81.99,14.12 U4.17
  Bottom 0.152: v58.75,15.34 58.75,15.8 61.11,18.16 69.65,18.16 v71.25,16.56 | v73.38,15.04 78.72,15.04 v79.63,14.12
N$21  (via drill 0.35)
  Top 0.152: v57.07,14.12 56.08,14.12 LED_RX.C | v73.46,16.79 73.46,16.33 75.89,13.89 75.89,10.54 76.12,10.31 76.66,10.31 U4.10
  Bottom 0.152: v57.07,14.12 57.07,14.58 62.79,20.3 69.19,20.3 69.42,20.52 71.4,20.52 73.46,18.47 v73.46,16.79
N$22
  Top 0.152: LED_TX.A 53.72,12.52 53.72,11.08 R1_USB.1
N$23
  Top 0.152: LED_RX.A 56.08,12.52 56.08,11.23 56.24,11.08 R2_USB.1
N$25
  Top 0.152: UMH3NFHATN.2 80.47,17.86 79.86,18.47 79.32,18.47 UMH3NFHATN.4 79.25,18.47 78.87,18.47 76.73,16.33 76.73,16.03 U4.1
N$27
  Top 0.152: UMH3NFHATN.1 81.15,17.25 80.62,17.25 80.09,17.78 79.32,17.78 UMH3NFHATN.5 79.25,17.78 78.87,17.78 78.49,17.4 78.49,16.64 77.19,15.34 76.73,15.34 U4.2
RESET  (via drill 0.35)
  Top 0.152: RESET_BUTTON.4 93.27,4.75 RESET_BUTTON.3 | RESET_BUTTON.4 | v79.1,22.2 80.7,23.8 R1_ESP.1 | v75.67,22.2 75.67,21.44 75.44,21.21 U$3.P$1 | v79.25,16.41 79.25,17.17 UMH3NFHATN.6 | v13.49,2.01 11.66,3.84 11.66,4.22 U$1.EN | v89.15,5.97 89.15,4.75 RESET_BUTTON.4
  Bottom 0.152: v13.49,2.01 16.84,2.01 17.53,1.32 30.4,1.32 34.21,5.13 38.94,5.13 40.62,3.45 40.62,2.77 41.38,2.01 44.73,2.01 45.72,3 45.72,3.68 64.24,22.2 v75.67,22.2 v79.1,22.2 79.25,22.05 v79.25,16.41 80.24,16.41 89.15,7.49 v89.15,5.97
RGB_B
  Top 0.152: R_B.2 40.77,8.48 33.6,8.48 31.32,10.77 31.32,10.85 30.86,11.3 30.02,11.3 29.18,12.14 27.81,12.14 23.09,7.42 23.09,4.29 U$1.IO27
RGB_G  (via drill 0.35)
  Top 0.152: v33.22,9.78 33.38,9.93 40.92,9.93 R_G.2 | v22.48,5.66 22.48,5.28 21.87,4.67 21.87,4.29 U$1.IO26
  Bottom 0.152: v33.22,9.78 31.62,9.78 27.43,5.59 22.55,5.59 v22.48,5.66
RGB_R  (via drill 0.35)
  Top 0.152: v38.33,6.88 40.84,6.88 R_R.2 | v27.05,2.24 22.17,2.24 20.57,3.84 20.57,4.22 U$1.IO25
  Bottom 0.152: v38.33,6.88 31.7,6.88 v27.05,2.24
RX0  (via drill 0.35)
  Top 0.152: v80.31,14.73 81.53,15.95 81.99,15.95 U4.20 | v68.5,2.01 66.75,2.01 65.76,3 65.76,3.68 v64.24,5.21 | v50.98,8.03 46.56,8.03 44.58,6.05 41.22,6.05 v41.15,5.97 | v35.43,16.79 35.43,18.39 32.69,21.13 32.69,23.19 31.62,24.26 15.77,24.26 14.25,22.73 14.25,22.28 U$1.RXD0
  Bottom 0.152: v80.31,14.73 80.31,12.9 70.87,3.45 70.87,2.69 70.18,2.01 v68.5,2.01 | v64.24,5.21 60.88,5.21 55.02,11.08 54.03,11.08 v50.98,8.03 | v41.15,5.97 41.15,6.96 35.43,12.67 v35.43,16.79
SCL  (via drill 0.35)
  Top 0.152: 38.75,14.62 39.32,15.19 42.06,15.19 42.22,15.34 42.22,16.18 40.77,17.63 39.93,17.63 SENSOR2.4 | 38.75,14.62 38.71,14.58 37.87,14.58 R2_PINH.1 | v49.23,6.27 48.69,6.81 48.69,7.11 LED1.4 | v47.78,4.83 45.8,4.83 45.64,4.98 45.03,4.98 44.35,4.29 44.35,3.23 J1.4 | v39.47,10.54 38.41,11.61 30.86,11.61 30.02,12.45 26.52,12.45 24.23,14.73 18.75,14.73 11.66,21.82 11.66,22.2 U$1.IO22 | v39.09,13.51 38.79,13.82 38.79,14.58 38.75,14.62
  Bottom 0.152: v47.78,4.83 v49.23,6.27 | J1.4 44.27,3.23 44.27,4.75 39.93,9.09 39.93,9.63 39.47,10.08 v39.47,10.54 39.09,10.92 v39.09,13.51
SDA  (via drill 0.35)
  Top 0.152: LED1.6 49.91,7.19 49.91,7.34 49.53,7.72 46.71,7.72 44.73,5.74 44.35,5.74 41.83,3.23 J1.3 | v34.82,15.72 35.97,14.58 R1_PINH.1 | v38.94,16.94 38.94,17.78 39.55,18.39 39.85,18.39 SENSOR2.3 | v15.47,20.68 15.47,22.2 U$1.IO21
  Bottom 0.152: 36.23,16.9 36.35,16.79 36.35,12.22 41.76,6.81 41.76,3.23 J1.3 | 36.23,16.9 35.74,17.4 35.13,17.4 34.82,17.09 v34.82,15.72 34.82,13.89 29.87,8.94 27.89,8.94 27.36,8.41 17.75,8.41 15.47,10.69 v15.47,20.68 | v38.94,16.94 36.27,16.94 36.23,16.9
TX0  (via drill 0.35)
  Top 0.152: v69.42,19.61 72.31,19.61 74.07,17.86 74.07,16.18 76.12,14.12 76.66,14.12 U4.4 | v58.45,18.77 v62.18,18.77 | v49,14.5 48.69,14.5 46.02,11.84 v43.89,11.84 | v41.22,11.84 38.63,11.84 37.87,12.6 30.33,12.6 28.88,14.05 25.38,14.05 19.36,20.07 14.71,20.07 12.95,21.82 12.95,22.2 U$1.TXD0
  Bottom 0.152: v69.42,19.61 69.04,19.61 68.12,18.69 62.26,18.69 v62.18,18.77 | v58.45,18.77 57.99,18.77 53.42,14.2 49.3,14.2 v49,14.5 | v41.22,11.84 v43.89,11.84
USB_DATA_N
  Top 0.3: R6_USB.1 85.59,11.44 C1_USB.1 87.5,11.44 87.5,11.85 88.5,12.85 88.66,12.69 MOLEX.2
USB_DATA_P
  Top 0.3: C2_USB.1 85.59,14.72 R5_USB.1 87.5,14.72 87.5,14.31 88.5,13.31 88.53,13.34 MOLEX.3
VIN
  Top 0.3: 63.95,10.44 63.2,11.19 64,11.19 | 63.95,10.44 65.5,8.89 65.5,6.8 66.25,6.05 Q1.2 65.82,5 64.87,5.95 U2.6 63.1,5.1 62.39,4.39 61.61,4.39 61.36,4.14 60.86,4.14 60.5,4.5 60.5,5.6 U2.5 U$6.P$1 | U2.8 63.15,7 63.66,7 63.95,7.29 63.95,10.44 | D3.1 68.14,10.73 68.14,11.22 67.17,12.19 65.81,12.19 64.81,11.19 64,11.19 | C1_PWR.1 64.08,12.31 R1_PWRUVLO.2 64.11,11.31 64,11.19
VIN_BAT  (via drill 0.35)
  Top 0.3: Q1.3 68.5,6.53 v68.5,7.5 | U3.3 71.45,10.95 v71.5,11 | C2_BAT.1 70.82,19 v72,19 | v34.5,4.5 35,5 37.5,5 37.5,5.62 R6-ESP1.2
  Bottom 0.3: 67.18,8 67.18,9.85 18650BATTHOLDER.P$5 65.5,11.53 65.5,14.65 18650BATTHOLDER.P$6 71.44,15.64 | 67.18,8 67.18,3.5 | 67.18,3.5 J1.13 | 71.44,15.64 18650BATTHOLDER.P$2 73.59,13.09 v71.5,11 | v68.5,7.5 68,8 67.18,8 | v34.5,4.5 34.5,2 35,1.5 65.18,1.5 67.18,3.5 | v72,19 72,16.2 71.44,15.64
VIN_USB
  Top 0.3: PFMF.050.2.1 78.69,1.5 70.5,1.5 69.72,2.28 J1.14 67,5.92 67,5.95 66.25,6.71 Q1.1 67.37,7.33 68.22,8.18 68.63,8.18 D3.2 | C5_USB.1 78.34,3.64 C4_USB.1 80.83,3.64 PFMF.050.2.1 | U4.15 81.92,12.65 81.36,12.65 81.07,12.36 PFMF.050.2.1 | D3.2 70.37,8.5 R1_PWRUSB.2 70.64,7.05 U3.4 | CHG_LED.A 70.1,13.09 C1_BAT.1 70.23,12.02 70.41,11.83 70.41,9.96 D3.2
VUSB
  Top 0.3: MOLEX.1 89.21,12.04 89.04,12.04 88.5,11.5 88.5,6.81 PFMF.050.2.2 85.57,6.19 C3_USB.1
(copper drawn outside any net)
  shapes: Top area x2